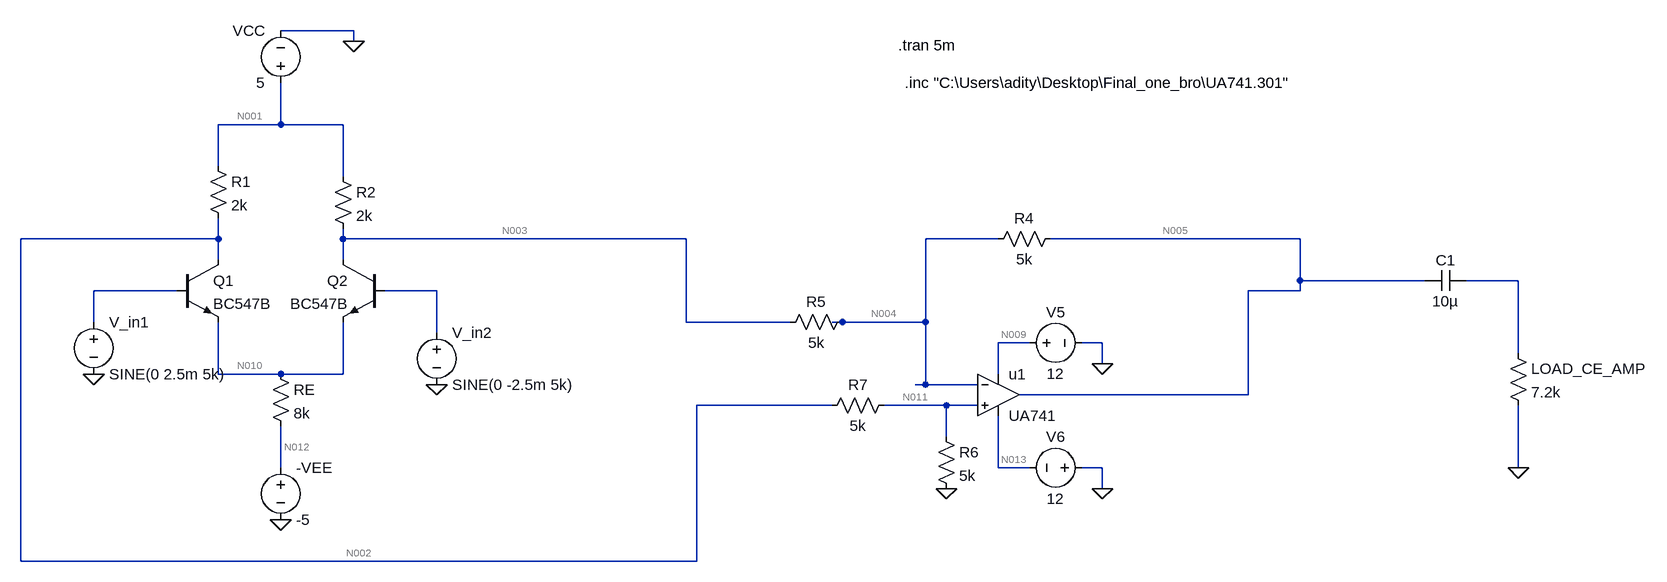
[diagram p0: schematic Differential_AMP.asc]
Differential_AMP.asc, the LTspice schematic file:
Version 4
SHEET 1 1652 680
WIRE -336 -256 -448 -256
WIRE -336 -240 -336 -256
WIRE -448 -112 -448 -176
WIRE -448 -112 -544 -112
WIRE -352 -112 -448 -112
WIRE -544 -48 -544 -112
WIRE -352 -32 -352 -112
WIRE -544 64 -544 32
WIRE -544 64 -848 64
WIRE -352 64 -352 48
WIRE 176 64 -352 64
WIRE 656 64 544 64
WIRE 1120 64 736 64
WIRE -544 96 -544 64
WIRE -352 96 -352 64
WIRE 1120 128 1120 64
WIRE 1312 128 1120 128
WIRE 1456 128 1376 128
WIRE -608 144 -736 144
WIRE -208 144 -288 144
WIRE 1120 144 1120 128
WIRE 1120 144 1040 144
WIRE -736 192 -736 144
WIRE 176 192 176 64
WIRE 336 192 176 192
WIRE 416 192 400 192
WIRE 544 192 544 64
WIRE 544 192 416 192
WIRE -208 208 -208 144
WIRE 704 224 656 224
WIRE 816 224 784 224
WIRE 1456 240 1456 128
WIRE 816 256 816 224
WIRE -544 272 -544 192
WIRE -448 272 -544 272
WIRE -352 272 -352 192
WIRE -352 272 -448 272
WIRE 656 272 656 224
WIRE 544 288 544 192
WIRE 544 288 528 288
WIRE 624 288 544 288
WIRE 1040 304 1040 144
WIRE 1040 304 688 304
WIRE 400 320 192 320
WIRE 576 320 480 320
WIRE 624 320 576 320
WIRE 576 368 576 320
WIRE -448 416 -448 352
WIRE 656 416 656 336
WIRE 704 416 656 416
WIRE 816 416 784 416
WIRE 1456 416 1456 320
WIRE 816 448 816 416
WIRE -848 560 -848 64
WIRE 192 560 192 320
WIRE 192 560 -848 560
FLAG -736 272 0
FLAG -208 288 0
FLAG -448 496 0
FLAG -336 -240 0
FLAG 816 256 0
FLAG 816 448 0
FLAG 576 448 0
FLAG 1456 416 0
SYMBOL cap 1376 112 R90
WINDOW 0 0 32 VBottom 2
WINDOW 3 32 32 VTop 2
SYMATTR InstName C1
SYMATTR Value 10µ
SYMBOL npn -608 96 R0
SYMATTR InstName Q1
SYMATTR Value BC547B
SYMBOL npn -288 96 M0
SYMATTR InstName Q2
SYMATTR Value BC547B
SYMBOL voltage -736 176 R0
WINDOW 123 0 0 Left 0
WINDOW 39 0 0 Left 0
SYMATTR InstName V_in1
SYMATTR Value SINE(0 2.5m 5k)
SYMBOL voltage -208 192 R0
WINDOW 123 0 0 Left 0
WINDOW 39 0 0 Left 0
SYMATTR InstName V_in2
SYMATTR Value SINE(0 -2.5m 5k)
SYMBOL res -560 -64 R0
SYMATTR InstName R1
SYMATTR Value 2k
SYMBOL res -368 -48 R0
SYMATTR InstName R2
SYMATTR Value 2k
SYMBOL res -464 256 R0
SYMATTR InstName RE
SYMATTR Value 8k
SYMBOL voltage -448 -160 R180
WINDOW 0 24 96 Left 2
WINDOW 3 24 16 Left 2
WINDOW 123 0 0 Left 0
WINDOW 39 0 0 Left 0
SYMATTR InstName VCC
SYMATTR Value 5
SYMBOL voltage -448 400 R0
SYMATTR InstName -VEE
SYMATTR Value -5
SYMBOL res 752 48 R90
WINDOW 0 0 56 VBottom 2
WINDOW 3 32 56 VTop 2
SYMATTR InstName R4
SYMATTR Value 5k
SYMBOL res 432 176 R90
WINDOW 0 0 56 VBottom 2
WINDOW 3 32 56 VTop 2
SYMATTR InstName R5
SYMATTR Value 5k
SYMBOL OpAmps\\opamp2 656 240 R0
SYMATTR InstName u1
SYMATTR Value UA741
SYMBOL voltage 688 224 R270
WINDOW 0 32 56 VTop 2
WINDOW 3 -32 56 VBottom 2
WINDOW 123 0 0 Left 0
WINDOW 39 0 0 Left 0
SYMATTR InstName V5
SYMATTR Value 12
SYMBOL voltage 800 416 R90
WINDOW 0 -32 56 VBottom 2
WINDOW 3 32 56 VTop 2
WINDOW 123 0 0 Left 0
WINDOW 39 0 0 Left 0
SYMATTR InstName V6
SYMATTR Value 12
SYMBOL res 560 352 R0
SYMATTR InstName R6
SYMATTR Value 5k
SYMBOL res 496 304 R90
WINDOW 0 0 56 VBottom 2
WINDOW 3 32 56 VTop 2
SYMATTR InstName R7
SYMATTR Value 5k
SYMBOL res 1440 224 R0
SYMATTR InstName LOAD_CE_AMP
SYMATTR Value 7.2k
TEXT 502 -234 Left 2 !.tran 5m
TEXT 512 -176 Left 2 !.inc "C:\\Users\\adity\\Desktop\\Final_one_bro\\UA741.301"

The netlist it stands for:
* Differential_AMP.asc
C1 N006 N005 10µ
Q1 N002 N007 N010 0 BC547B
Q2 N003 N008 N010 0 BC547B
V_in1 N007 0 SINE(0 2.5m 5k)
V_in2 N008 0 SINE(0 -2.5m 5k)
R1 N001 N002 2k
R2 N001 N003 2k
RE N010 N012 8k
VCC N001 0 5
V§-VEE N012 0 -5
R4 N005 N004 5k
R5 N004 N003 5k
Xu1 N011 N004 N009 N013 N005 UA741  ; pins In+ In- V+ V- OUT
V5 N009 0 12
V6 0 N013 12
R6 N011 0 5k
R7 N011 N002 5k
R§LOAD_CE_AMP N006 0 7.2k
.model NPN NPN
.model PNP PNP
.lib standard.bjt
.tran 5m
.inc "C:\Users\adity\Desktop\Final_one_bro\UA741.301"
.backanno
.end

* Results of the author's LTspice run, read from the files saved beside the schematic
* Operating Point, zero values left out:
*   V(n005) = -39.52 µV
*   V(n002) = 3.71 V
*   V(n010) = -603.2 mV
*   V(n003) = 3.71 V
*   V(n001) = 5 V
*   V(n012) = -5 V
*   V(n004) = 1.855 V
*   V(n013) = -12 V
*   V(n009) = 12 V
*   V(n011) = 1.855 V
*   Ic(Q1) = 273.9 µA
*   Ib(Q1) = 913.7 nA
*   Ie(Q1) = -274.8 µA
*   Ic(Q2) = 273.9 µA
*   Ib(Q2) = 913.7 nA
*   Ie(Q2) = -274.8 µA
*   I(R1) = 644.9 µA
*   I(R2) = 644.9 µA
*   I(Re) = 549.6 µA
*   I(R4) = -371 µA
*   I(R5) = -371.1 µA
*   I(R6) = 371 µA
*   I(R7) = -371.1 µA
*   I(V_in1) = -913.7 nA
*   I(V_in2) = -913.7 nA
*   I(Vcc) = -1.29 mA
*   I(-vee) = 549.6 µA
*   I(V5) = -1.335 mA
*   I(V6) = -1.335 mA
*   Ix(u1:1) = 80.52 nA
*   Ix(u1:2) = 80.47 nA
*   Ix(u1:3) = 1.335 mA
*   Ix(u1:4) = -1.335 mA
*   Ix(u1:5) = 371 µA
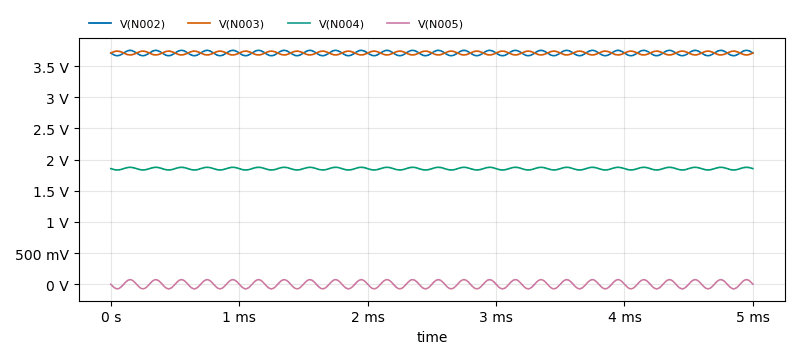
[diagram p1: Transient Analysis of Differential_AMP.asc, plotted from the saved traces]
* Transient Analysis, 1 run:
*   V(N002): min 3.667 V, max 3.753 V, average 3.71 V, rms 3.71 V, last 3.71 V
*   V(N003): min 3.68 V, max 3.741 V, average 3.71 V, rms 3.71 V, last 3.71 V
*   V(N004): min 1.833 V, max 1.876 V, average 1.855 V, rms 1.855 V, last 1.855 V
*   V(N005): min -73.33 mV, max 73.25 mV, average -39.52 µV, rms 51.98 mV, last 572.7 µV